# EAGLE schematic SAM21 (EAGLE 7.7.0)
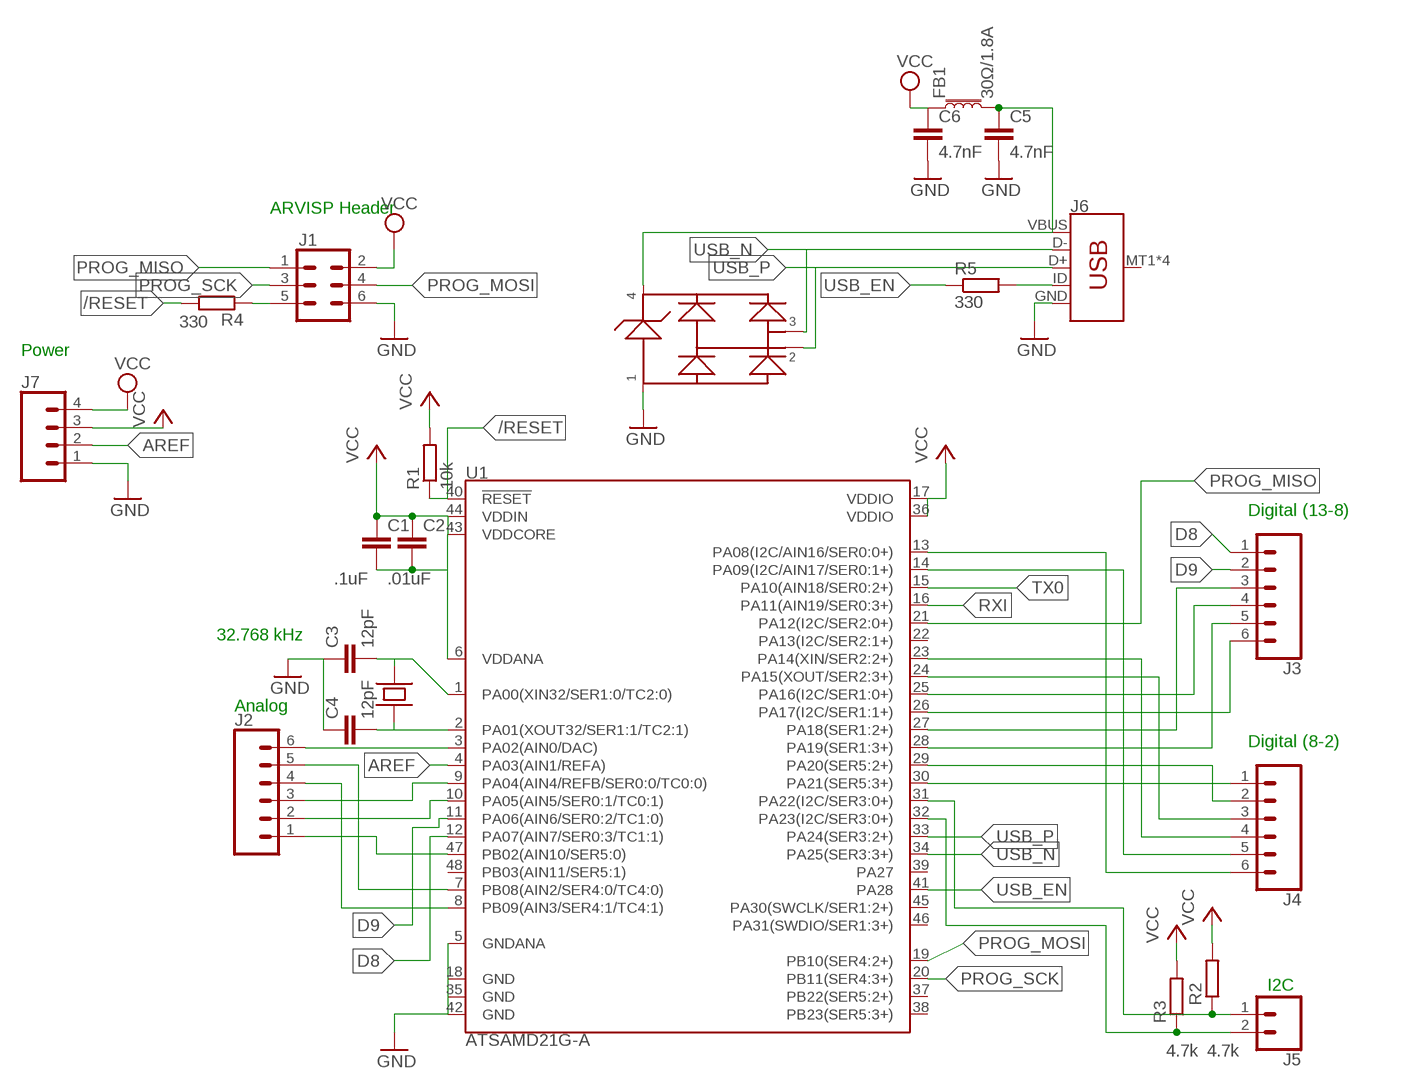
[diagram p0: schematic, sheet 1]

## Parts
C1  .1uF  C-EUC0603  [C0603]
C2  .01uF  C-EUC0603  [C0603]
C3  12pF  C-EUC0603  [C0603]
C4  12pF  C-EUC0603  [C0603]
C5  4.7nF  C-EUC0603  [C0603]
C6  4.7nF  C-EUC0603  [C0603]
FB1  30Ω/1.8A  FERRITE_BEAD-0603  [0603]
J1  CONN_03X2FEMALE_SMD  [2X3_SMD]
J2  CONN_06LONGPADS  [1X06_LONGPADS]
J3  CONN_06LONGPADS  [1X06_LONGPADS]
J4  CONN_06LONGPADS  [1X06_LONGPADS]
J5  CONN_02PTH3  [1X02_LONGPADS]
J6  USB_MICRO-B_SMT  [USB-MICROB]
J7  CONN_04LONGPADS  [1X04_LONGPADS]
R1  10k  R-EU_R0603  [R0603]
R2  4.7k  R-EU_R0603  [R0603]
R3  4.7k  R-EU_R0603  [R0603]
R4  330  R-EU_R0603  [R0603]
R5  330  R-EU_R0603  [R0603]
U1  ATSAMD21G-A  [TQFP-48]
U$1  CM200  [4-SOJ]
U$2  PRTR5V0U2X  [SOT143B]

## Nets
5V: J1.2 ; supply symbol labelled VCC
/RESET: R1.1 R4.2 U1.40(!RESET!)
AREF: J7.2 U1.4(PA03(AIN1/REFA))
D8: J3.1 U1.12(PA07(AIN7/SER0:3/TC1:1))
D9: J2.4 J3.2 U1.8(PB09(AIN3/SER4:1/TC4:1)) U1.11(PA06(AIN6/SER0:2/TC1:0))
GND: C3.1 C4.1 C5.2 C6.2 J1.6 J6.GND J7.1 U1.5(GNDANA) U1.18(GND) U1.35(GND) U1.42(GND) U$2.P$1
N$1: J4.1 U1.30(PA21(SER5:3+))
N$2: J2.6 U1.3(PA02(AIN0/DAC))
N$3: J2.5 U1.7(PB08(AIN2/SER4:0/TC4:0))
N$4: J4.2 U1.29(PA20(SER5:2+))
N$5: J2.3 U1.9(PA04(AIN4/REFB/SER0:0/TC0:0))
N$6: J2.2 U1.10(PA05(AIN5/SER0:1/TC0:1))
N$7: J2.1 U1.47(PB02(AIN10/SER5:0))
N$8: J3.6 U1.26(PA17(I2C/SER1:1+))
N$9: J3.5 U1.28(PA19(SER1:3+))
N$10: J3.4 U1.25(PA16(I2C/SER1:0+))
N$11: J3.3 U1.27(PA18(SER1:2+))
N$12: J4.3 U1.24(PA15(XOUT/SER2:3+))
N$13: J4.4 U1.23(PA14(XIN/SER2:2+))
N$14: J4.5 U1.14(PA09(I2C/AIN17/SER0:1+))
N$15: J4.6 U1.13(PA08(I2C/AIN16/SER0:0+))
N$16: U1.17(VDDIO) U1.36(VDDIO)
N$17: J5.1 R2.1 U1.31(PA22(I2C/SER3:0+))
N$18: C4.2 U1.2(PA01(XOUT32/SER1:1/TC2:1)) U$1.P$1
N$19: J5.2 R3.1 U1.32(PA23(I2C/SER3:0+))
N$20: J1.5 R4.1
N$21: C3.2 U1.1(PA00(XIN32/SER1:0/TC2:0)) U$1.P$4
N$22: C5.1 FB1.2 J6.VBUS U$2.P$4
N$23: J6.ID R5.2
PROG_MISO: J1.1 U1.21(PA12(I2C/SER2:0+))
PROG_MOSI: J1.4 U1.19(PB10(SER4:2+))
PROG_SCK: J1.3 U1.20(PB11(SER4:3+))
RXI: U1.16(PA11(AIN19/SER0:3+))
TX0: U1.15(PA10(AIN18/SER0:2+))
USB_EN: R5.1 U1.41(PA28)
USB_N: J6.D- U1.34(PA25(SER3:3+)) U$2.P$3
USB_P: J6.D+ U1.33(PA24(SER3:2+)) U$2.P$2
VCC: C1.1 C1.2 C2.1 C2.2 C6.1 FB1.1 J7.3 J7.4 R1.2 R2.2 R3.2 U1.6(VDDANA) U1.43(VDDCORE) U1.44(VDDIN)
Unconnected: J6.MT1(SHIELD) J6.MT2(SHIELD) J6.P$1(SHIELD) J6.P$2(SHIELD) U1.22(PA13(I2C/SER2:1+)) U1.37(PB22(SER5:2+)) U1.38(PB23(SER5:3+)) U1.39(PA27) U1.45(PA30(SWCLK/SER1:2+)) U1.46(PA31(SWDIO/SER1:3+)) U1.48(PB03(AIN11/SER5:1))

## Notes on the sheet
- ARVISP Header
- Power
- Digital (13-8)
- 32.768 kHz
- Analog
- Digital (8-2)
- I2C

## Library data of the parts
C1-C6 = rcl:C-EU: CAPACITOR, European symbol
FB1 = SparkFun-Coils:FERRITE_BEAD: Ferrite Bead (blocks, cores, rings, chokes, etc.) Inductor with layers of ferrite used to suppress high frequencies. Often used to isolate high frequency noise. SparkFun Products: IOIO-OTG - V2.2 <https://www.sparkfun.com/products/13613> SparkFun SAMD21 Mini Breakout <https://www.sparkfun.com/products/13664> SparkFun 6 Degrees of Freedom Breakout - LSM6DS3 <https://www.sparkfun.com/products/13339> SparkFun SAMD21 Dev Breakout <https://www.sparkfun.com/products/13672>; PROD_ID: NDUC-07859
J1 = SparkFun-Connectors:CONN_03X2: Multi connection point. Often used as Generic Header-pin footprint for 0.1 inch spaced/style header connections You can populate with any combo of single row headers, but if you'd like an exact match, check these: Header - 2x3 (Male, 0.1") <https://www.sparkfun.com/products/12807> (PRT-12807) Header - 2x3 (Female, 0.1") <https://www.sparkfun.com/products/13010> (PRT-13010) 2x3 Pin Shrouded Header <https://www.sparkfun.com/products/10877> (PRT-10877) On any of the 0.1 inch spaced packages, you can populate with these: Break Away Headers - Straight <https://www.sparkfun.com/products/116> (PRT-00116) Break Away Male Headers - Right Angle <https://www.sparkfun.com/products/553> (PRT-00553) Female Headers <https://www.sparkfun.com/products/115> (PRT-00115) Break Away Headers - Machine Pin <https://www.sparkfun.com/products/117> (PRT-00117) Break Away Female Headers - Swiss Machine Pin <https://www.sparkfun.com/products/743> (PRT-00743) Special note: the shrouded connector mates well with our 3x2 ribbon cables: Ribbon Crimp Connector - 6-pin (2x3, Female) <https://www.sparkfun.com/products/10651> (PRT-10651) Ribbon Cable - 6 wire (15ft) <https://www.sparkfun.com/products/10646> (PRT-10646); PROD_ID: CONN-11290
J2-J4 = SparkFun-Connectors:CONN_06: Multi connection point. Often used as Generic Header-pin footprint for 0.1 inch spaced/style header connections On any of the 0.1 inch spaced packages, you can populate with these: Break Away Headers - Straight <https://www.sparkfun.com/products/116> (PRT-00116) Break Away Male Headers - Right Angle <https://www.sparkfun.com/products/553> (PRT-00553) Female Headers <https://www.sparkfun.com/products/115> (PRT-00115) Break Away Headers - Machine Pin <https://www.sparkfun.com/products/117> (PRT-00117) Break Away Female Headers - Swiss Machine Pin <https://www.sparkfun.com/products/743> (PRT-00743) Arduino Stackable Header - 6 Pin <https://www.sparkfun.com/products/9280> (PRT-09280) For SCREWTERMINALS and SPRING TERMINALS visit here: Screw Terimnals on SparkFun.com <https://www.sparkfun.com/search/results?term=Screw+Terminals> (5mm/3.5mm/2.54mm spacing) This device is also useful as a general connection point to wire up your design to another part of your project. Our various solder wires solder well into these plated through hole pads. Hook-Up Wire - Assortment (Stranded, 22 AWG) <https://www.sparkfun.com/products/11375> (PRT-11375) Hook-Up Wire - Assortment (Solid Core, 22 AWG) <https://www.sparkfun.com/products/11367> (PRT-11367) View the entire wire category on our website here <https://www.sparkfun.com/categories/141>
J5 = SparkFun-Connectors:CONN_02: Multi connection point. Often used as Generic Header-pin footprint for 0.1 inch spaced/style header connections On any of the 0.1 inch spaced packages, you can populate with these: Break Away Headers - Straight <https://www.sparkfun.com/products/116> (PRT-00116) Break Away Male Headers - Right Angle <https://www.sparkfun.com/products/553> (PRT-00553) Female Headers <https://www.sparkfun.com/products/115> (PRT-00115) Break Away Headers - Machine Pin <https://www.sparkfun.com/products/117> (PRT-00117) Break Away Female Headers - Swiss Machine Pin <https://www.sparkfun.com/products/743> (PRT-00743) For SCREWTERMINALS and SPRING TERMINALS visit here: Screw Terimnals on SparkFun.com <https://www.sparkfun.com/search/results?term=Screw+Terminals> (5mm/3.5mm/2.54mm spacing) This device is also useful as a general connection point to wire up your design to another part of your project. Our various solder wires solder well into these plated through hole pads. Hook-Up Wire - Assortment (Stranded, 22 AWG) <https://www.sparkfun.com/products/11375> (PRT-11375) Hook-Up Wire - Assortment (Solid Core, 22 AWG) <https://www.sparkfun.com/products/11367> (PRT-11367) View the entire wire category on our website here <https://www.sparkfun.com/categories/141> Special notes: Molex polarized connector foot print use with: PRT-08233 with associated crimp pins and housings. 2.54_SCREWTERM for use with PRT-10571. 3.5mm Screw Terminal footprints for PRT-08084 5mm Screw Terminal footprints for use with PRT-08432
J6 = SparkFun-Connectors:USB_MICRO-B: USB Type Micro-B Connector Male/female and PTH/SMT variants SparkFun Products: SparkFun microB USB Breakout <https://www.sparkfun.com/products/12035> SparkFun USB microB Plug Breakout <https://www.sparkfun.com/products/10031> SparkFun ESP8266 Thing <https://www.sparkfun.com/products/13231>; PROD_ID: CONN-09505; SF_ID: PRT-08533
J7 = SparkFun-Connectors:CONN_04: Multi connection point. Often used as Generic Header-pin footprint for 0.1 inch spaced/style header connections On any of the 0.1 inch spaced packages, you can populate with these: Break Away Headers - Straight <https://www.sparkfun.com/products/116> (PRT-00116) Break Away Male Headers - Right Angle <https://www.sparkfun.com/products/553> (PRT-00553) Female Headers <https://www.sparkfun.com/products/115> (PRT-00115) Break Away Headers - Machine Pin <https://www.sparkfun.com/products/117> (PRT-00117) Break Away Female Headers - Swiss Machine Pin <https://www.sparkfun.com/products/743> (PRT-00743) For SCREWTERMINALS and SPRING TERMINALS visit here: Screw Terimnals on SparkFun.com <https://www.sparkfun.com/search/results?term=Screw+Terminals> (5mm/3.5mm/2.54mm spacing) This device is also useful as a general connection point to wire up your design to another part of your project. Our various solder wires solder well into these plated through hole pads. Hook-Up Wire - Assortment (Stranded, 22 AWG) <https://www.sparkfun.com/products/11375> (PRT-11375) Hook-Up Wire - Assortment (Solid Core, 22 AWG) <https://www.sparkfun.com/products/11367> (PRT-11367) View the entire wire category on our website here <https://www.sparkfun.com/categories/141> Special notes: Molex polarized connector foot print use with SKU : PRT-08231 with associated crimp pins and housings. 1MM SMD Version SKU: PRT-10208; PROD_ID: CONN-09696
R1-R5 = rcl:R-EU_: RESISTOR, European symbol
U1 = SparkFun-IC-Microcontroller:ATSAMD21G: Atmel SAMD21G SMART ARM-Based Microcontroller The Atmel ® | SMART ™ SAM D21 is a series of low-power microcontrollers using the 32-bit ARM ® Cortex ® -M0+ processor, and ranging from 32- to 64-pins with up to 256KB Flash and 32KB of SRAM. The SAM D21 devices operate at a maximum frequency of 48MHz and reach 2.46 CoreMark/MHz. They are designed for simple and intuitive migration with identical peripheral modules, hex compatible code, identical linear address map and pin compatible migration paths between all devices in the product series. All devices include intelligent and flexible peripherals, Atmel Event System for inter-peripheral signaling, and support for capacitive touch button, slider and wheel user interfaces. Datasheet <https://cdn.sparkfun.com/datasheets/Dev/Arduino/Boards/Atmel-42181-SAM-D21_Datasheet.pdf> SparkFun Products SparkFun SAMD21 Mini Breakout <https://www.sparkfun.com/products/13664> (DEV-13664) SparkFun SAMD21 Dev Breakout <https://www.sparkfun.com/products/13672> (DEV-13672); PROD_ID: IC-13064
U$1 = Custom:CM200: Crystal Oscilator, 32.768 kHz
U$2 = Custom:PRTR5V0U2X: TV ESD Protection Diode